# EAGLE design espAlarm (EAGLE 7.5.0)
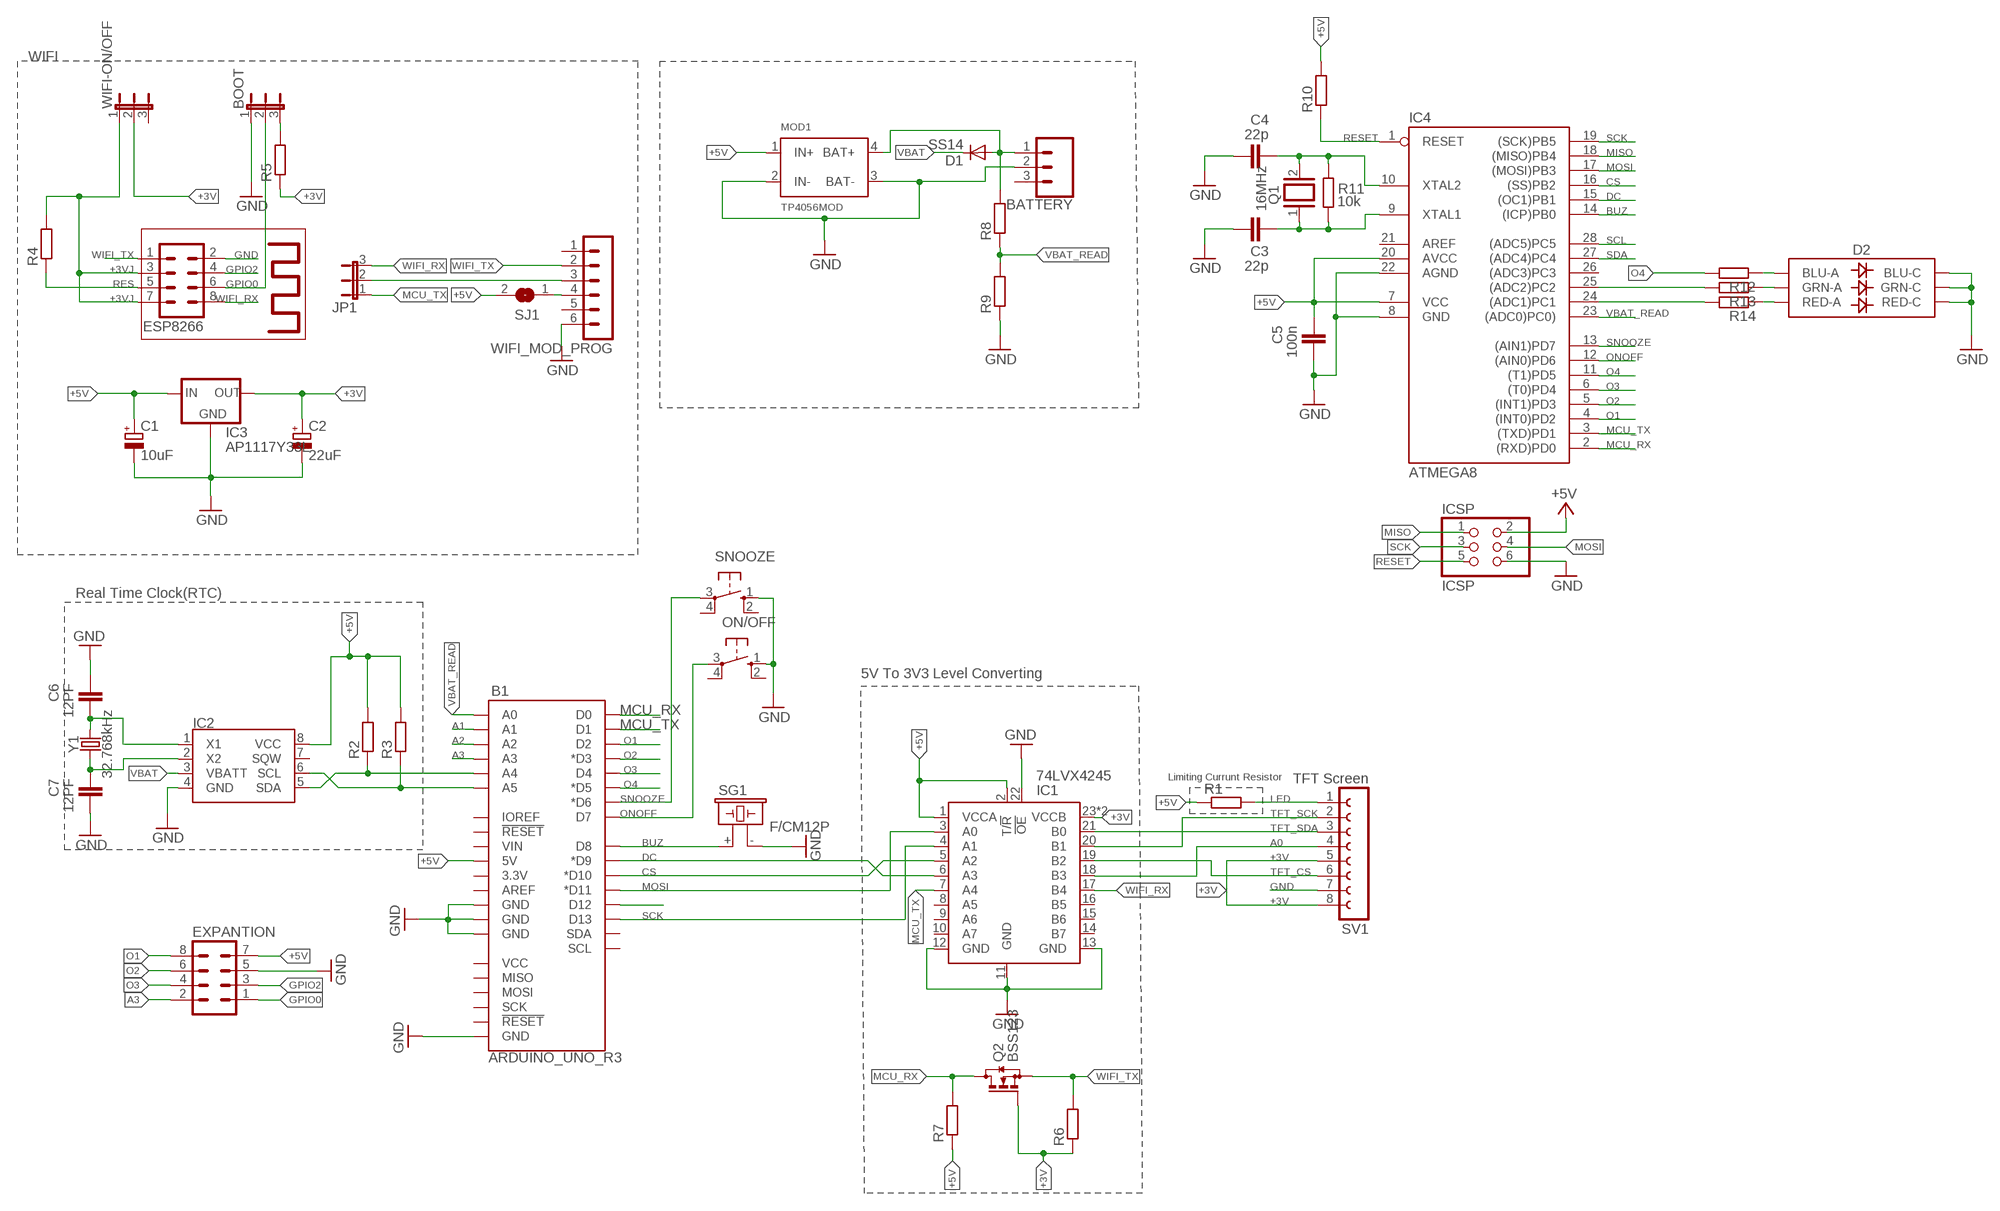
[diagram p0: schematic, sheet 1]

## Parts
B1  ARDUINO_UNO_R3  [ARDUINO_R3]
BATTERY  CONN_03JST-PTH-VERT  [JST-3-PTH-VERT]
BOOT  JP2E  [JP2]
C1  10uF  CPOL-EUE2.5-7  [E2,5-7]
C2  22uF  CPOL-EUE2.5-7  [E2,5-7]
C3  22p  C-EUC0805  [C0805]
C4  22p  C-EUC0805  [C0805]
C5  100n  C-EUC0805  [C0805]
C6  12PF  C-EUC0805  [C0805]
C7  12PF  C-EUC0805  [C0805]
D1  SS14  DIODE-DO214AC  [DO214AC]
D2  LED-RGBNO_IC  [LED-TRICOLOR-5050]
ESP8266  MA04-2  [MA04-2]
EXPANTION  MA04-2  [MA04-2]
IC1  74LVX4245  [TSSOP-24]
IC2  DS1307  [DIP-08]
IC3  AP1117Y33L  REG_FIXED  [SOT-89-3]
IC4  ATMEGA8  AT90S4433P  [DIL28-3]
ICSP  ICSP  PINHD-2X3  [2X03]
JP1  JP2E  [JP2]
MOD1  TP4056MOD  [TP4056BRD]
ON/OFF  10-XX  [B3F-10XX]
Q1  16MHz  SMARTPRJ_XTAL/S  [SMARTPRJ_QS]
Q2  BSS123  [SOT23]
R1  R-EU_M1206  [M1206]
R2  R-EU_M1206  [M1206]
R3  R-EU_M1206  [M1206]
R4  R-EU_M1206  [M1206]
R5  R-EU_M1206  [M1206]
R6  R-EU_M1206  [M1206]
R7  R-EU_M1206  [M1206]
R8  R-EU_M1206  [M1206]
R9  R-EU_M1206  [M1206]
R10  R-EU_M1206  [M1206]
R11  10k  R-EU_M1206  [M1206]
R12  R-EU_M1206  [M1206]
R13  R-EU_M1206  [M1206]
R14  R-EU_M1206  [M1206]
SG1  F/CM12P  [F/CM12P]
SJ1  SJ  [SJ]
SNOOZE  10-XX  [B3F-10XX]
SV1  TFT Screen  FE08-1  [FE08]
WIFI-ON/OFF  JP2E  [JP2]
WIFI_MOD_PROG  MA06-1  [MA06-1]
Y1  32.768kHz  CRYSTAL-32.768KHZPTH-2X6  [CRYSTAL-PTH-2X6-CYL]

## Nets
+3V: C2.+ IC1.23(VCCB) IC1.24(VCCB) IC3.3(OUT) IC3.4(OUT) Q2.1(G) R5.1 R6.1 SV1.5 SV1.8 WIFI-ON/OFF.2
+3VJ: ESP8266.3 ESP8266.7 R4.2 WIFI-ON/OFF.1
+5V: B1.5V C1.+ C5.2 EXPANTION.7 IC1.1(VCCA) IC1.2(T/!R) IC2.8(VCC) IC3.1(IN) IC4.7(VCC) IC4.20(AVCC) ICSP.2 MOD1.1(IN+) R1.1 R2.2 R3.2 R7.1 R10.2 SJ1.2
A0: IC1.18(B3) SV1.4
A1: B1.A1 IC4.24((ADC1)PC1) R14.2
A2: B1.A2 IC4.25((ADC2)PC2) R13.2
A3: B1.A3 EXPANTION.2
BUZ: B1.D8 IC4.14((ICP)PB0) SG1.+
CS: B1.D10(*D10) IC1.5(A2) IC4.16((SS)PB2)
DC: B1.D9(*D9) IC1.6(A3) IC4.15((OC1)PB1)
GND: B1.GND@1(GND) B1.GND@2(GND) B1.GND@3(GND) B1.GND@4(GND) BATTERY.2 BOOT.1 C1.- C2.- C3.1 C4.1 C5.1 C6.2 C7.1 D2.4(BLU-C) D2.5(RED-C) D2.6(GRN-C) ESP8266.2 EXPANTION.5 IC1.11(GND) IC1.12(GND) IC1.13(GND) IC1.22(!OE) IC2.4(GND) IC3.2(GND) IC4.8(GND) IC4.22(AGND) ICSP.6 MOD1.2(IN-) MOD1.3(BAT-) ON/OFF.1(S) R9.1 SG1.- SNOOZE.1(S) SV1.7 WIFI_MOD_PROG.6
GPIO0: BOOT.2 ESP8266.6 EXPANTION.1
GPIO2: ESP8266.4 EXPANTION.3
LED: R1.2 SV1.1
MCU_RX: B1.D0 IC4.2((RXD)PD0) Q2.3(D) R7.2
MCU_TX: B1.D1 IC1.7(A4) IC4.3((TXD)PD1) JP1.1
MISO: IC4.18((MISO)PB4) ICSP.1
MOSI: B1.D11(*D11) IC1.3(A0) IC4.17((MOSI)PB3) ICSP.4
N$1: JP1.2 WIFI_MOD_PROG.3
N$2: BOOT.3 R5.2
N$3: C6.1 IC2.1(X1) Y1.2
N$4: C7.2 IC2.2(X2) Y1.1
N$5: SJ1.1 WIFI_MOD_PROG.4
N$7: BATTERY.1 D1.A MOD1.4(BAT+) R8.2
N$8: C3.2 IC4.9(XTAL1) Q1.1 R11.1
N$9: C4.2 IC4.10(XTAL2) Q1.2 R11.2
N$12: B1.D12
N$15: D2.3(BLU-A) R12.1
N$16: D2.1(GRN-A) R13.1
N$17: D2.2(RED-A) R14.1
O1: B1.D2 EXPANTION.8 IC4.4((INT0)PD2)
O2: B1.D3(*D3) EXPANTION.6 IC4.5((INT1)PD3)
O3: B1.D4 EXPANTION.4 IC4.6((T0)PD4)
O4: B1.D5(*D5) IC4.11((T1)PD5) R12.2
ONOFF: B1.D7 IC4.12((AIN0)PD6) ON/OFF.3(P)
RES: ESP8266.5 R4.1
RESET: IC4.1(RESET) ICSP.5 R10.1
SCK: B1.D13 IC1.4(A1) IC4.19((SCK)PB5) ICSP.3
SCL: B1.A5 IC2.6(SCL) IC4.28((ADC5)PC5) R3.1
SDA: B1.A4 IC2.5(SDA) IC4.27((ADC4)PC4) R2.1
SNOOZE: B1.D6(*D6) IC4.13((AIN1)PD7) SNOOZE.3(P)
TFT_CS: IC1.19(B2) SV1.6
TFT_SCK: IC1.20(B1) SV1.2
TFT_SDA: IC1.21(B0) SV1.3
VBAT: D1.C IC2.3(VBATT)
VBAT_READ: B1.A0 IC4.23((ADC0)PC0)) R8.1 R9.2
WIFI_RX: ESP8266.8 IC1.17(B4) JP1.3
WIFI_TX: ESP8266.1 Q2.2(S) R6.2 WIFI_MOD_PROG.2
Unconnected: B1.3.3V B1.AREF B1.IOREF B1.MISO B1.MOSI B1.RESET@1(!RESET!) B1.RESET@2(!RESET!) B1.SCK B1.SCL B1.SDA B1.VCC B1.VIN BATTERY.3 IC1.8(A5) IC1.9(A6) IC1.10(A7) IC1.14(B7) IC1.15(B6) IC1.16(B5) IC2.7(SQW) IC4.26((ADC3)PC3) ON/OFF.2(S1) ON/OFF.4(P1) SNOOZE.2(S1) SNOOZE.4(P1) WIFI-ON/OFF.3 WIFI_MOD_PROG.1 WIFI_MOD_PROG.5

## Notes on the sheet
- WIFI
- Real Time Clock(RTC)
- 5V To 3V3 Level Converting
- Limiting Currunt Resistor

## Power pins joined to a net without a drawn wire
AREF: IC4.21(AREF)

## Library data of the parts
B1 = SparkFun-Boards:ARDUINO_UNO_R3: Arduino R3 Footprint with SPI header Arduino Uno R3 Compatible Footprint. Matches PCB size of the original board. SparkFun Products: SAMD21 Dev Breakout <https://www.sparkfun.com/products/13672> RedBoard <https://www.sparkfun.com/products/12757> R3 Stackable Headers <https://www.sparkfun.com/products/11417>
BATTERY = SparkFun-Connectors:CONN_03: Multi connection point. Often used as Generic Header-pin footprint for 0.1 inch spaced/style header connections On any of the 0.1 inch spaced packages, you can populate with these: Break Away Headers - Straight <https://www.sparkfun.com/products/116> (PRT-00116) Break Away Male Headers - Right Angle <https://www.sparkfun.com/products/553> (PRT-00553) Female Headers <https://www.sparkfun.com/products/115> (PRT-00115) Break Away Headers - Machine Pin <https://www.sparkfun.com/products/117> (PRT-00117) Break Away Female Headers - Swiss Machine Pin <https://www.sparkfun.com/products/743> (PRT-00743) Stackable Header - 3 Pin (Female, 0.1") <https://www.sparkfun.com/products/13875> (PRT-13875) For SCREWTERMINALS and SPRING TERMINALS visit here: Screw Terimnals on SparkFun.com <https://www.sparkfun.com/search/results?term=Screw+Terminals> (5mm/3.5mm/2.54mm spacing) This device is also useful as a general connection point to wire up your design to another part of your project. Our various solder wires solder well into these plated through hole pads. Hook-Up Wire - Assortment (Stranded, 22 AWG) <https://www.sparkfun.com/products/11375> (PRT-11375) Hook-Up Wire - Assortment (Solid Core, 22 AWG) <https://www.sparkfun.com/products/11367> (PRT-11367) View the entire wire category on our website here <https://www.sparkfun.com/categories/141> Special notes: Molex polarized connector foot print use with SKU : PRT-08232 with associated crimp pins and housings.; PROD_ID: CONN-13230
BOOT JP1 WIFI-ON/OFF = jumper:JP2E: JUMPER
C1 C2 = rcl:CPOL-EU: POLARIZED CAPACITOR, European symbol
C3-C7 = rcl:C-EU: CAPACITOR, European symbol
D1 = diode:DIODE-: DIODE
D2 = SparkFun-LED:LED-RGB: LED-RGB 6 pin RGB LED (no common connector) Packages: PLCC-6 LED-TRICOLOR-5050 - No built-in IC SparkFun Products: Digital Sandbox <https://www.sparkfun.com/products/12651> LED- SMD RGB <https://www.sparkfun.com/products/10866>; PROD_ID: DIO-10298
ESP8266 EXPANTION = con-lstb:MA04-2: PIN HEADER; OC_FARNELL: unknown; OC_NEWARK: unknown
IC1 = MyLib:74LVX4245
IC2 = MyLib:DS1307
IC3 = MyLib:REG_FIXED
IC4 = atmel:AT90S4433: MICROCONTROLLER 4 Kbytes FLASH 128 bytes SRAM 256 bytes EEPROM UART 6-channel 10 bit ADC
ICSP = pinhead:PINHD-2X3: PIN HEADER
MOD1 = MyLib:TP4056MOD
ON/OFF SNOOZE = switch-omron:10-XX: OMRON SWITCH; MPN: B3F-1000; OC_FARNELL: 176432; OC_NEWARK: 36M3542
Q1 = arduino_Uno_Rev3-02-TH:SMARTPRJ_XTAL/S: CRYSTAL
Q2 = transistor-small-signal:BSS123: N-CHANNEL MOS FET
R1-R14 = rcl:R-EU_: RESISTOR, European symbol
SG1 = buzzer:F/CM12P: BUZZER Source: Buerklin; OC_FARNELL: unknown; OC_NEWARK: unknown
SJ1 = jumper:SJ: SMD solder JUMPER
SV1 = con-lsta:FE08-1: FEMALE HEADER; OC_FARNELL: unknown; OC_NEWARK: unknown
WIFI_MOD_PROG = con-lstb:MA06-1: PIN HEADER; OC_FARNELL: unknown; OC_NEWARK: unknown
Y1 = SparkFun-Clocks:CRYSTAL-32.768KHZ: 32.768kHz Crystal Frequency: 32.768kHz Frequency Stability: ±20ppm Load Capacitance: 12.5pF (PTH-2X6 & SMD-3.2X1.5), 6pF (SMD-2X6) SparkFun Products: SparkFun BigTime Watch Kit <https://www.sparkfun.com/products/11734> SparkFun nRF52832 Breakout <https://www.sparkfun.com/products/13990> SparkFun Real Time Clock Module <https://www.sparkfun.com/products/12708>; PROD_ID: XTAL-10112

## Net classes
2 gnd: width 0.305 mm, drill 0.508 mm, clearance 0.152 mm
3 usbvcc: width 0.508 mm, drill 0.508 mm, clearance 0.152 mm

## Board
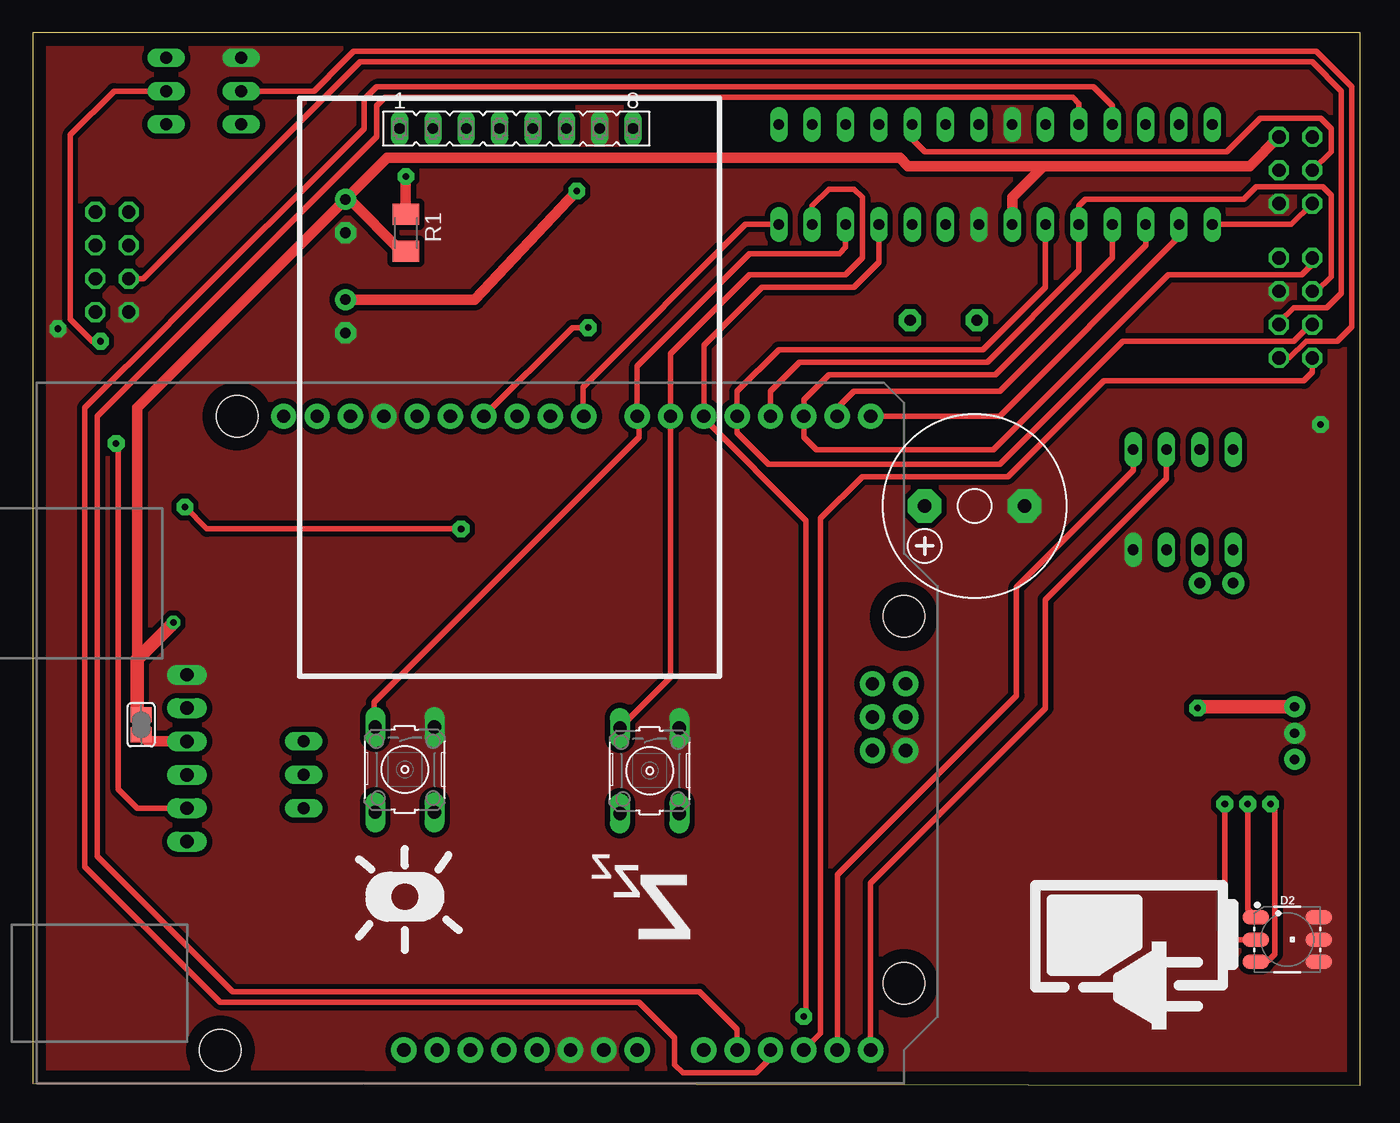
[diagram p1: board, top side]
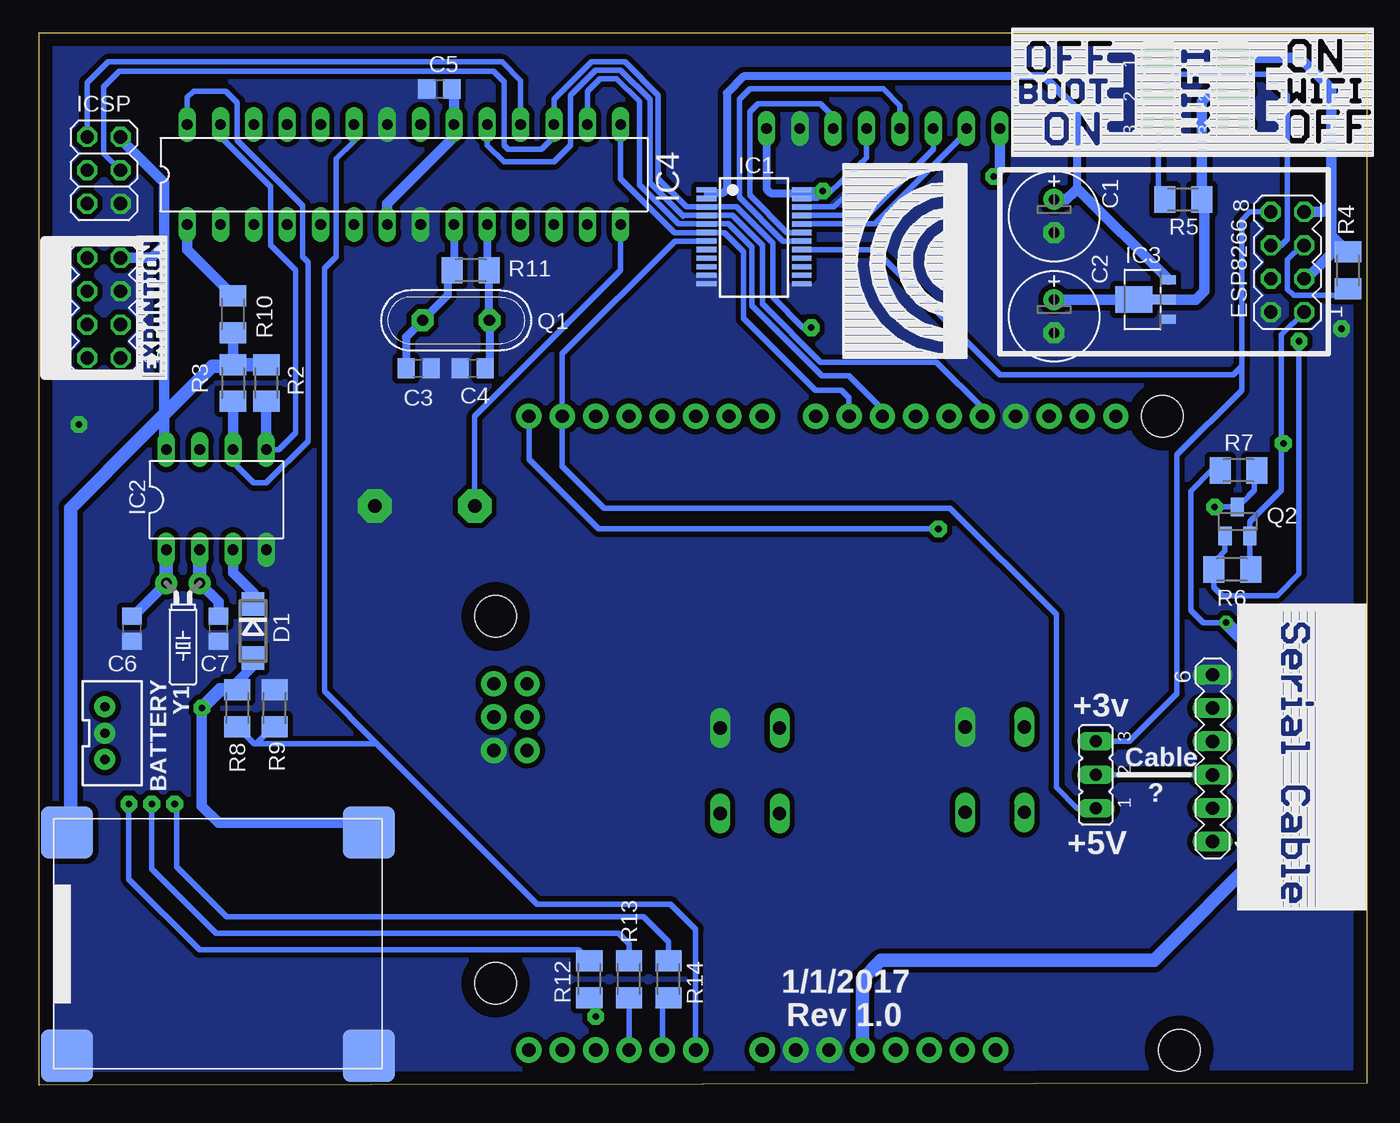
[diagram p2: board, bottom side, seen from below]

Size 101.11 x 80.16 mm. Coordinates in mm from the lower left corner, seen from the top.
Outline: 0,0.16 101.11,0 101.11,80.16 0,80.16 0,0.16
Copper layers (1*16): Top 0.035mm / dielectric 1.5mm / Bottom 0.035mm
Design rules "default": minimum track width 10mil, minimum drill 24mil, track to track 8mil, track to pad 8mil, pad to pad 8mil, via to via 8mil, smd to smd 8mil, copper to edge 40mil, drill to drill 8mil, minimum pad ring 10mil, minimum via ring 8mil, stop-mask expansion 4mil, vias tented up to drill 0mil, thermal gap 10mil

### Footprints (pad centres in the part's own frame; a part is rotated, then mirrored left to right if it is on the bottom)
ARDUINO_R3 = drill 1.016 pad 1.93: 3.3V 2.54,-24.13; 5V 5.08,-24.13; A0 17.78,-24.13; A1 20.32,-24.13; A2 22.86,-24.13; A3 25.4,-24.13; A4 27.94,-24.13; A5 30.48,-24.13; AREF -9.144,24.13; D0 30.48,24.13; D1 27.94,24.13; D2 25.4,24.13; D3 22.86,24.13; D4 20.32,24.13; D5 17.78,24.13; D6 15.24,24.13; D7 12.7,24.13; D8 8.636,24.13; D9 6.096,24.13; D10 3.556,24.13; D11 1.016,24.13; D12 -1.524,24.13; D13 -4.064,24.13; GND@1 7.62,-24.13; GND@2 10.16,-24.13; GND@3 -6.604,24.13; GND@4 33.16,-1.32; IOREF -2.54,-24.13; MISO 30.62,3.76; MOSI 33.16,1.22; NC -5.08,-24.13; RESET@1 0,-24.13; RESET@2 30.62,-1.32; SCK 30.62,1.22; SCL -14.224,24.13; SDA -11.684,24.13; VCC 33.16,3.76; VIN 12.7,-24.13 | hole 3.175: -17.78,24.13; 33.02,8.89; 33.02,-19.05; -19.05,-24.13
JST-3-PTH-VERT = drill 0.7 pad 1.6: 1 -2,-0.55; 2 0,-0.55; 3 2,-0.55
JP2 = drill 0.914 long: 1 -2.54,0; 2 0,0; 3 2.54,0
E2,5-7 = drill 0.813 pad 1.6: + -1.27,0 | drill 0.813 pad 1.6 octagon: - 1.27,0
C0805 = smd 1.3 x 1.5: 1 -0.95,0; 2 0.95,0
DO214AC = smd 1.8 x 1.7: A 2.05,0; C -2.05,0
LED-TRICOLOR-5050 = smd 2 x 1.1: 1 -2.4,1.7; 2 -2.4,0; 3 -2.4,-1.7; 4 2.4,-1.7; 5 2.4,0; 6 2.4,1.7
MA04-2 = drill 1.016 octagon: 1 -3.81,-1.27; 2 -3.81,1.27; 3 -1.27,-1.27; 4 -1.27,1.27; 5 1.27,-1.27; 6 1.27,1.27; 7 3.81,-1.27; 8 3.81,1.27
TSSOP-24 = smd 0.4 x 1.5: 1 -4.225,-3.625; 2 -3.575,-3.625; 3 -2.925,-3.625; 4 -2.275,-3.625; 5 -1.625,-3.625; 6 -0.975,-3.625; 7 -0.325,-3.625; 8 0.325,-3.625; 9 0.975,-3.625; 10 1.625,-3.625; 11 2.275,-3.625; 12 2.925,-3.625; 13 2.925,3.625; 14 2.275,3.625; 15 1.625,3.625; 16 0.975,3.625; 17 0.325,3.625; 18 -0.325,3.625; 19 -0.975,3.625; 20 -1.625,3.625; 21 -2.275,3.625; 22 -2.925,3.625; 23 -3.575,3.625; 24 -4.225,3.625
DIP-08 = drill 0.813 long: 1 -3.81,-3.81; 2 -1.27,-3.81; 3 1.27,-3.81; 4 3.81,-3.81; 5 3.81,3.81; 6 1.27,3.81; 7 -1.27,3.81; 8 -3.81,3.81
SOT-89-3 = smd 0.7 x 1.1: 1 1.5,-1.75; 2 -1.5,-1.75 | smd 0.7 x 1.8: 3 0,-1.4 | smd 2 x 2.8: 4 0,0.9
DIL28-3 = drill 0.813 long: 1 -16.51,-3.81; 2 -13.97,-3.81; 3 -11.43,-3.81; 4 -8.89,-3.81; 5 -6.35,-3.81; 6 -3.81,-3.81; 7 -1.27,-3.81; 8 1.27,-3.81; 9 3.81,-3.81; 10 6.35,-3.81; 11 8.89,-3.81; 12 11.43,-3.81; 13 13.97,-3.81; 14 16.51,-3.81; 15 16.51,3.81; 16 13.97,3.81; 17 11.43,3.81; 18 8.89,3.81; 19 6.35,3.81; 20 3.81,3.81; 21 1.27,3.81; 22 -1.27,3.81; 23 -3.81,3.81; 24 -6.35,3.81; 25 -8.89,3.81; 26 -11.43,3.81; 27 -13.97,3.81; 28 -16.51,3.81
2X03 = drill 1.016 octagon: 1 -2.54,-1.27; 2 -2.54,1.27; 3 0,-1.27; 4 0,1.27; 5 2.54,-1.27; 6 2.54,1.27
TP4056BRD = smd 4 x 4: 1 -11.7,9.11; 2 -11.7,-7.89; 3 11.3,-7.89; 4 11.3,9.11
B3F-10XX = drill 1.016 long: 1 -3.251,2.261; 2 3.251,2.261; 3 -3.251,-2.261; 4 3.251,-2.261
SMARTPRJ_QS = drill 0.85 pad 1.676 octagon: 1 -2.54,0; 2 2.54,0
SOT23 = smd 1 x 1.4: 1 -0.95,-1.1; 2 0.95,-1.1; 3 0,1.1
M1206 = smd 1.6 x 2: 1 -1.4,0; 2 1.4,0
F/CM12P = drill 1.016 pad 2.54 octagon: + 3.81,0; - -3.81,0
SJ = smd 1.168 x 1.6: 1 -0.762,0; 2 0.762,0
FE08 = drill 0.813 long: 1 -8.89,0; 2 -6.35,0; 3 -3.81,0; 4 -1.27,0; 5 1.27,0; 6 3.81,0; 7 6.35,0; 8 8.89,0
MA06-1 = drill 1.016 long: 1 -6.35,0; 2 -3.81,0; 3 -1.27,0; 4 1.27,0; 5 3.81,0; 6 6.35,0
CRYSTAL-PTH-2X6-CYL = drill 0.813 pad 1.676: 1 -1.27,0; 2 1.27,0

### Placement (x,y rotation side)
B1  33.34,26.83 0 top
BATTERY  95.57,26.83 270 bottom
BOOT  15.88,75.72 270 bottom
C1  23.81,66.2 270 bottom
C2  23.81,58.58 270 bottom
C3  72.23,54.61 180 bottom
C4  68.1,54.61 0 bottom
C5  70.64,75.88 0 bottom
C6  94.06,34.77 270 bottom
C7  87.47,34.77 90 bottom
D1  84.85,34.61 270 bottom
D2  95.57,11.11 0 top
ESP8266  6.03,62.71 90 bottom
EXPANTION  96.2,59.21 90 bottom
IC1  46.67,63.98 270 bottom
IC2  87.63,44.61 0 bottom
IC3  16.83,59.85 90 bottom
IC4  73.34,69.37 0 bottom
ICSP  96.2,69.69 270 bottom
JP1  20.64,23.65 90 bottom
MOD1  87.31,10.16 0 bottom
ON/OFF  28.34,24.05 270 top
Q1  69.37,58.26 0 bottom
Q2  9.84,42.94 0 bottom
R1  28.42,64.93 90 top
R2  83.82,53.5 90 bottom
R3  86.36,53.5 90 bottom
R4  1.43,62.07 90 bottom
R5  13.97,67.47 180 bottom
R6  10.24,39.29 0 bottom
R7  9.76,46.83 0 bottom
R8  86.04,28.73 90 bottom
R9  83.19,28.73 270 bottom
R10  86.36,58.74 270 bottom
R11  68.26,62.07 0 bottom
R12  59.21,8.1 270 bottom
R13  56.2,8.1 270 bottom
R14  53.18,8.1 270 bottom
SG1  71.75,44.13 180 top
SJ1  8.26,27.46 90 top
SNOOZE  46.99,23.97 270 top
SV1  36.83,72.87 0 top
WIFI-ON/OFF  10.16,75.72 270 bottom
WIFI_MOD_PROG  11.75,24.92 90 bottom
Y1  90.17,38.26 180 bottom

### Tracks (layer width: path | path; a pad name or v marks a point on that pad's centre or on a via)
+3V  (via drill 0.5 pad 1.27)
  Top 0.406: WIFI-ON/OFF.2 6.19,75.72 2.86,72.39 2.86,58.34 4.52,56.67 v5.16,56.67
  Top 0.813: C2.+ 33.66,59.85 v41.43,68.1
  Bottom 0.406: SV1.5 38.1,70.64 40.8,68.1 v41.43,68.1 | IC3.4 IC3.3 13.18,59.85 13.02,59.69 | IC1.23 41.83,67.55 v41.43,68.1 | IC1.24 42.01,68.2 v41.43,68.1 | Q2.1 10.79,40.72 11.43,40.08 11.43,39.5 R6.1 11.64,37.94 11,37.31 6.83,37.31 5.16,38.97 v5.16,56.67
  Bottom 0.61: 38.1,73.82 SV1.5 | SV1.8 45.72,68.26 45.4,67.94 41.75,67.94 v41.43,68.1
  Bottom 0.813: IC3.4 C2.+ | IC3.3 13.02,59.85 12.38,60.48 12.38,67.28 R5.1 12.57,74.9 11.75,75.72 WIFI-ON/OFF.2
+3VJ
  Bottom 0.813: WIFI-ON/OFF.1 5.08,78.26 2.7,75.88 2.7,67.15 | 2.7,67.15 3.33,66.52 ESP8266.7 | 2.7,67.15 2.7,65.25 2.7,64.74 | 2.7,64.74 R4.2 | ESP8266.3 4.6,61.44 2.7,63.34 2.7,64.74
+5V  (via drill 0.5 pad 1.02)
  Top 0.813: ICSP.2 92.71,70.01 76.99,70.01 | C1.+ 26.99,70.64 66.04,70.64 66.67,70.01 76.99,70.01 | C1.+ 7.94,51.59 7.94,31.99 | IC4.7 74.61,67.63 76.99,70.01 | C1.+ 24.13,67.47 28.07,63.53 R1.1 | 7.94,28.54 SJ1.2
  Top 1.016: 7.94,28.54 7.94,31.99 7.94,32.46 v10.72,35.24
  Bottom 0.406: 15.16,61.44 IC3.1 | IC1.2 IC1.1 50.04,67.94 49.69,67.94 | R7.1 11.83,46.83 13.41,45.24 13.41,36.19 12.46,35.24 v10.72,35.24
  Bottom 0.61: 49.69,67.94 49.05,67.94 48.74,68.26 48.74,75.56 47.47,76.83 24.61,76.83 22.09,74.32 22.09,68.29 | 22.09,68.29 22.09,68.23 22.23,68.1 | 22.09,68.29 22.07,68.26
  Bottom 0.813: C5.2 69.53,75.72 IC4.20 69.53,72.23 74.61,67.15 IC4.7 | IC3.1 22.03,68.3 22.07,68.26 22.23,68.1 22.86,67.47 C1.+ | R10.2 R3.2 | 92.87,49.85 93.11,49.61 | ICSP.2 94.93,72.07 91.6,68.74 91.6,63.98 | 91.6,63.98 91.6,51.12 91.6,48.58 IC2.8 | EXPANTION.7 92.55,63.02 91.6,63.98
  Bottom 1.016: MOD1.1 98.74,20.11 98.74,43.97 93.11,49.61 91.6,51.12 87.95,54.77 86.49,54.77 R3.2 R2.2 | B1.5V 38.42,8.1 36.99,9.52 16.19,9.52 7.94,17.78 7.94,32.46 v10.72,35.24
A0
  Bottom 0.406: IC1.18 44.46,64.3 47.78,67.63 47.78,75.09 46.99,75.88 36.83,75.88 35.56,74.61 SV1.4
A1
  Top 0.406: IC4.24 79.69,74.77 79.22,75.25 26.83,75.25 26.19,74.61 26.19,72.23 4.92,50.96 4.92,17.46 15.24,7.14 50.8,7.14 53.66,4.29 B1.A1
  Bottom 0.406: B1.A1 53.66,6.22 R14.2
A2
  Top 0.406: IC4.25 82.23,74.61 80.8,76.04 26.19,76.04 25.24,75.09 25.24,72.87 10.48,58.1 10.4,58.02 3.97,51.59 3.97,16.67 14.29,6.35 46.2,6.35 48.9,3.65 48.9,1.59 49.53,0.95 55.09,0.95 56.2,2.06 B1.A2
  Bottom 0.406: R13.2 B1.A2
A3
  Top 0.406: EXPANTION.2 97.47,54.29 96.84,53.66 81.6,53.66 74.3,46.35 63.18,46.35 60.01,43.18 60.01,3.97 B1.A3
BUZ
  Top 0.406: IC4.14 54.29,65.56 41.91,53.18 41.91,51.02 B1.D8
  Bottom 0.406: SG1.+ 67.94,50.96 56.83,62.07 IC4.14
CS
  Bottom 0.406: IC4.16 59.37,75.72 58.42,76.68 57.15,76.68 55.4,74.93 55.4,68.58 52.42,65.6 IC1.5 48.62,65.6 46.83,63.82 46.83,59.37 41.51,54.05 39.45,54.05 36.89,51.5 B1.D10
DC
  Bottom 0.406: IC4.15 56.83,69.06 52.73,64.95 IC1.6 48.92,64.95 47.47,63.5 47.47,58.42 41.99,52.94 40.01,52.94 39.43,52.37 B1.D9
GND  (via drill 0.5 pad 1.27)
  Bottom 0.406: IC1.22 40.57,66.9 39.69,67.79
  other vias: 98.11,50.32 1.91,57.63
  pour Top (isolate 0.406, no thermals): 0.24,80.17 101.68,80.17 101.76,-0.16 -0.32,-0.32
  pour Bottom (isolate 0.406, no thermals): 0.32,80.01 101.12,80.17 101.76,-0.16 -0.32,0
GPIO0
  Top 0.406: BOOT.2 21.43,75.72 23.73,78.03 24.45,78.74 97.79,78.74 100.49,76.04 100.49,57.78 99.38,56.67 97,56.67 95.73,55.4 EXPANTION.1
  Bottom 0.406: BOOT.2 14.61,76.99 7.62,76.99 6.03,75.41 6.03,64.45 6.51,63.98 ESP8266.6
GPIO2
  Top 0.406: EXPANTION.3 94.93,58.1 96.04,59.21 98.58,59.21 99.69,60.32 99.69,75.72 97.47,77.95 24.92,77.95 8.41,61.44 ESP8266.4
LED  (via drill 0.5 pad 1.27)
  Top 0.813: R1.2 v28.42,69.21
  Bottom 0.813: SV1.1 27.94,69.69 v28.42,69.21
MCU_RX  (via drill 0.5 pad 1.27)
  Top 0.406: IC4.2 87.31,64.61 73.66,50.96 B1.D0 | v32.62,42.39 13.26,42.39 v11.59,44.05
  Bottom 0.406: R7.2 8.57,46.62 8.57,45.32 9,44.9 9,44.89 Q2.3 9.85,44.05 v11.59,44.05 | B1.D0 63.82,47.7 58.5,42.39 v32.62,42.39
MCU_TX
  Top 0.406: B1.D1 61.28,51.59 62.55,52.86 73.66,52.86 84.77,63.98 IC4.3
  Bottom 0.406: B1.D1 61.28,51.59 | IC1.7 52.7,64.3 61.28,55.72 B1.D1 | B1.D1 61.28,47.15 58.1,43.97 31.75,43.97 23.65,35.88 23.65,22.7 22.07,21.11 JP1.1
MISO
  Bottom 0.406: ICSP.1 97.47,76.36 95.89,77.95 65.88,77.95 64.45,76.52 IC4.18
MOSI  (via drill 0.5 pad 1.27)
  Top 0.406: B1.D11 41.1,57.71 v42.31,57.71
  Bottom 0.406: ICSP.4 96.2,70.96 96.2,76.04 95.01,77.23 66.52,77.23 65.72,76.44 65.72,71.6 65.41,71.28 62.87,71.28 61.91,72.23 IC4.17 61.91,75.09 59.05,77.95 56.52,77.95 53.98,75.41 53.98,69.06 51.82,66.9 IC1.3 48.01,66.9 45.24,64.13 45.24,60.01 42.94,57.71 v42.31,57.71
N$1
  Bottom 0.406: WIFI_MOD_PROG.3 JP1.2
N$2
  Bottom 0.406: R5.2 15.88,67.47 BOOT.3
N$3
  Bottom 0.813: C6.1 93.58,36.12 Y1.2
  Bottom 1.016: IC2.1 Y1.2
N$4
  Bottom 0.813: C7.2 87.47,36.83 Y1.1
  Bottom 1.016: Y1.1 IC2.2
N$5
  Top 0.813: WIFI_MOD_PROG.4 8.76,26.19 SJ1.1
N$7  (via drill 0.5 pad 1.27)
  Top 1.016: BATTERY.1 88.84,28.83 v88.74,28.73
  Bottom 0.813: v88.74,28.73 88.74,21.27 87.47,20 76.75,20 MOD1.4 | R8.2 86.04,30.72 84.77,31.99 84.77,32.48 D1.A
  Bottom 1.016: R8.2 87.34,30.13 v88.74,28.73
N$8
  Bottom 0.61: IC4.9 69.53,62.2 R11.1 70.01,62.07 70.01,60.17 Q1.1 73.18,56.99 73.18,54.45 C3.2
N$9
  Bottom 0.61: IC4.10 66.99,62.2 R11.2 66.86,58.29 Q1.2 66.83,54.93 C4.2
N$15  (via drill 0.5 pad 1.27)
  Top 0.406: D2.3 93.28,9.52 94.14,9.52 94.61,10 94.61,21.11 v94.3,21.43
  Bottom 0.406: R12.1 60.04,10.32 88.9,10.32 94.3,15.72 v94.3,21.43
N$16  (via drill 0.5 pad 1.27)
  Top 0.406: 93.12,12.86 D2.1 92.55,13.43 v92.55,21.43
  Bottom 0.406: R13.1 56.2,10.79 56.99,11.59 87.63,11.59 92.55,16.51 v92.55,21.43
N$17  (via drill 0.5 pad 1.27)
  Top 0.406: 93.01,10.95 D2.2 91.6,11.11 90.81,11.91 v90.81,21.43
  Bottom 0.406: R14.1 53.18,10.95 55.09,12.86 86.84,12.86 90.65,16.67 90.65,21.27 v90.81,21.43
O1
  Top 0.406: IC4.4 82.23,63.02 73.34,54.13 60.64,54.13 58.74,52.23 B1.D2 58.74,49.37 59.69,48.42 73.18,48.42 86.52,61.75 96.68,61.75 97.47,62.55 EXPANTION.8
O2
  Top 0.406: B1.D3 56.2,52.86 58.42,55.09 72.71,55.09 79.69,62.07 IC4.5 79.69,66.99 80.17,67.47 92.23,67.47 93.19,68.42 98.27,68.42 98.9,67.79 98.9,61.59 97.79,60.48 EXPANTION.6
O3
  Top 0.406: IC4.6 77.15,60.8 72.39,56.04 56.83,56.04 53.66,52.86 B1.D4 53.66,49.69 56.04,47.31 73.66,47.31 83.03,56.67 96.04,56.67 97.31,57.94 EXPANTION.4
O4  (via drill 0.5 pad 1.27)
  Top 0.406: IC4.11 64.45,62.71 62.55,60.8 55.56,60.8 51.12,56.36 B1.D5 51.12,50.8 58.9,43.02 58.9,5.4 v58.74,5.24
  Bottom 0.406: v58.74,5.24 58.74,6.22 R12.2
ONOFF
  Top 0.406: IC4.12 61.91,63.82 61.44,63.34 54.61,63.34 46.04,54.77 B1.D7 46.2,50.8 46.2,49.37 26,29.17 ON/OFF.3
RES
  Bottom 0.406: ESP8266.5 4.92,63.98 6.03,62.86 6.03,60.64 5.56,60.17 1.93,60.17 R4.1
RESET
  Top 0.406: ICSP.5 95.89,65.56 IC4.1
  Bottom 0.813: IC4.1 89.85,63.63 R10.1
SCK
  Top 0.406: ICSP.3 98.9,71.12 98.9,72.87 98.11,73.66 93.5,73.66 90.96,71.12 67.94,71.12 66.99,72.07 IC4.19
  Bottom 0.406: IC4.19 66.99,71.6 65.72,70.33 61.91,70.33 60.64,71.6 60.64,75.41 58.74,77.31 56.83,77.31 54.61,75.09 54.61,68.74 52.12,66.25 | 52.12,66.25 52.07,66.2 | 52.12,66.25 IC1.4 48.31,66.25 46.04,63.98 46.04,59.53 41.59,55.09 32.78,55.09 29.29,51.59 29.29,50.97 B1.D13 29.37,51.05
SCL
  Top 0.406: IC2.6 86.36,46.2 77.15,36.99 77.15,28.73 63.82,15.4 B1.A5
  Bottom 0.406: IC2.6 86.36,47.47 84.77,45.88 83.82,45.88 80.64,49.05 80.64,62.71 81.04,63.1 81.04,66.99 86.04,71.99 86.04,74.85 86.92,75.72 89.38,75.72 89.85,75.25 IC4.28
  Bottom 0.813: IC2.6 R3.1
SDA
  Top 0.406: B1.A4 61.28,16.03 74.93,29.69 74.93,37.94 83.82,46.83 IC2.5
  Bottom 0.406: IC2.5 82.87,48.42 81.6,49.69 81.6,62.07 83.5,63.98 83.5,68.42 87.31,72.23 IC4.27
  Bottom 0.813: IC2.5 R2.1
SNOOZE
  Top 0.406: IC4.13 59.37,66.99 60.64,68.26 62.55,68.26 63.18,67.63 63.18,63.02 61.91,61.75 54.61,61.75 48.58,55.72 B1.D6 48.58,31.07 SNOOZE.3
TFT_CS
  Bottom 0.406: SV1.6 40.64,73.82 41.59,74.77 46.35,74.77 46.91,74.22 46.99,74.14 46.99,67.79 44.16,64.95 IC1.19
TFT_SCK
  Bottom 0.406: IC1.20 37.47,65.6 30.48,72.59 SV1.2
TFT_SDA
  Bottom 0.406: IC1.21 38.05,66.25 33.02,71.28 SV1.3
VBAT
  Bottom 0.813: IC2.3 86.36,39.05 84.77,37.46 84.77,36.74 D1.C
VBAT_READ
  Bottom 0.406: B1.A0 51.12,11.91 53.02,13.81 63.18,13.81 75.49,26.11 | IC4.23 77.15,71.91 78.5,70.56 78.5,63.1 79.38,62.23 79.38,30 75.49,26.11 | R8.1 84.74,26.03 84.61,26.03 | 84.61,26.03 75.56,26.03 75.49,26.11 | R9.2 83.31,27.33 84.61,26.03
WIFI_RX
  Bottom 0.406: IC1.17 37.46,63.65 27.94,54.13 10.16,54.13 9.53,54.77 | ESP8266.8 8.89,66.52 9.53,65.88 9.53,55.24 9.53,54.77 | JP1.3 18.1,26.19 14.45,29.84 14.45,48.02 9.53,52.94 9.53,54.77
WIFI_TX  (via drill 0.5 pad 1.27)
  Top 0.406: WIFI_MOD_PROG.2 7.94,21.11 6.51,22.54 6.51,48.74 v6.35,48.89
  Bottom 0.406: ESP8266.1 6.51,57.15 6.51,49.05 v6.35,48.89 6.51,48.74 6.51,45.32 8.89,42.94 Q2.2 8.89,39.34 R6.2

### Text on the board
tPlace: Z | Z | Z
bPlace: +3v | Cable | ? | +5V | 1/1/2017 | Rev 1.0